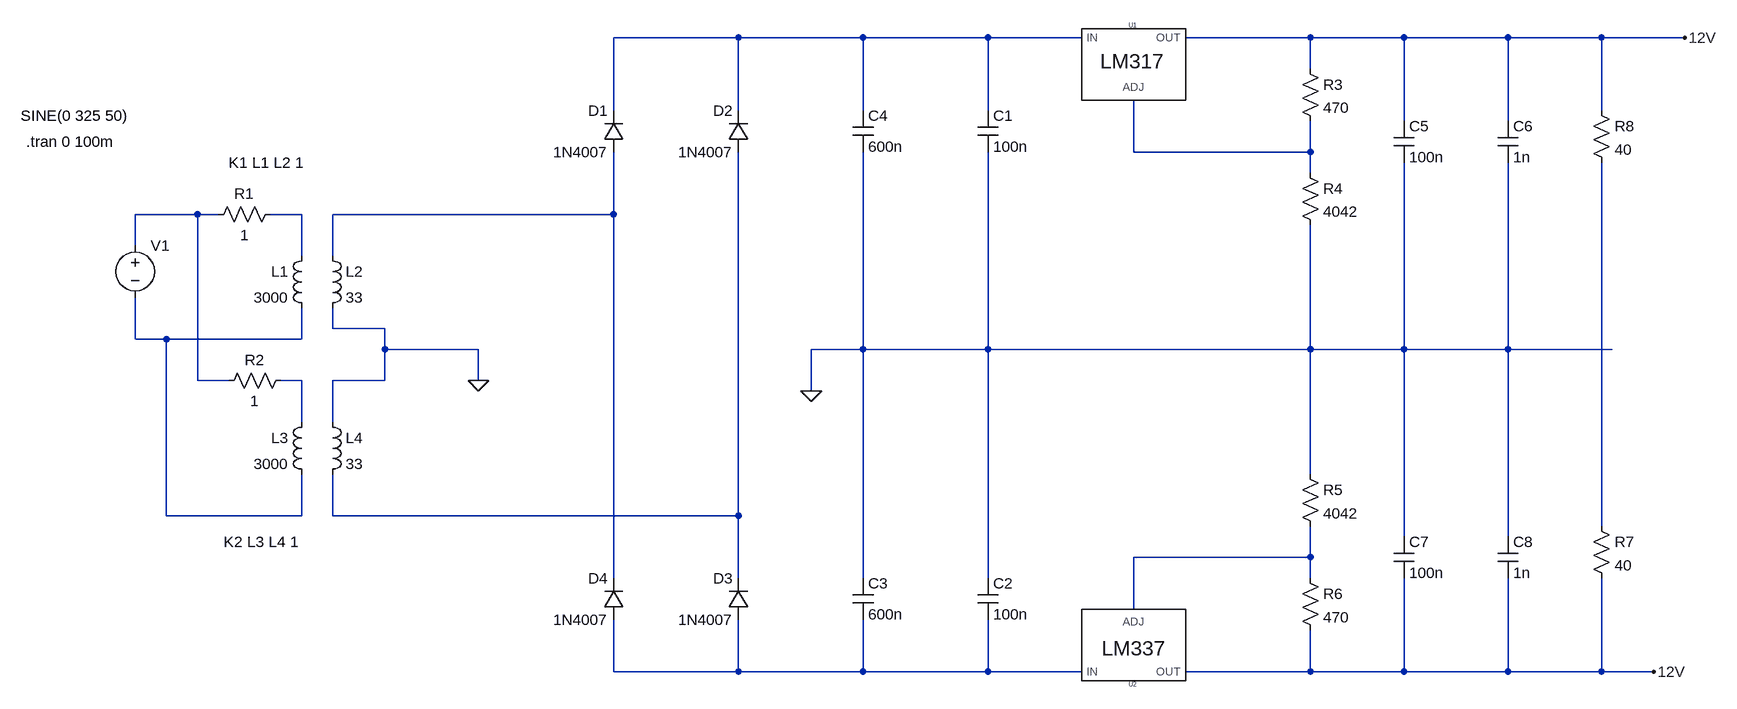
[diagram p0: schematic 3Teholähde.asc]
3Teholähde.asc, the LTspice schematic file:
Version 4.1
SHEET 1 2448 856
WIRE 928 -224 736 -224
WIRE 1120 -224 928 -224
WIRE 1312 -224 1120 -224
WIRE 1456 -224 1312 -224
WIRE 1808 -224 1616 -224
WIRE 1952 -224 1808 -224
WIRE 2112 -224 1952 -224
WIRE 2256 -224 2112 -224
WIRE 2384 -224 2256 -224
WIRE 1808 -176 1808 -224
WIRE 736 -112 736 -224
WIRE 928 -112 928 -224
WIRE 1120 -112 1120 -224
WIRE 1312 -112 1312 -224
WIRE 2256 -112 2256 -224
WIRE 1952 -96 1952 -224
WIRE 2112 -96 2112 -224
WIRE 1536 -48 1536 -128
WIRE 1808 -48 1808 -96
WIRE 1808 -48 1536 -48
WIRE 1808 -16 1808 -48
WIRE 96 48 0 48
WIRE 128 48 96 48
WIRE 256 48 208 48
WIRE 736 48 736 -48
WIRE 736 48 304 48
WIRE 0 96 0 48
WIRE 256 112 256 48
WIRE 304 112 304 48
WIRE 304 224 304 192
WIRE 384 224 304 224
WIRE 0 240 0 176
WIRE 48 240 0 240
WIRE 256 240 256 192
WIRE 256 240 48 240
WIRE 384 256 384 224
WIRE 528 256 384 256
WIRE 1120 256 1120 -48
WIRE 1120 256 1040 256
WIRE 1312 256 1312 -48
WIRE 1312 256 1120 256
WIRE 1808 256 1808 64
WIRE 1808 256 1312 256
WIRE 1952 256 1952 -32
WIRE 1952 256 1808 256
WIRE 2112 256 2112 -32
WIRE 2112 256 1952 256
WIRE 2272 256 2112 256
WIRE 96 304 96 48
WIRE 144 304 96 304
WIRE 256 304 224 304
WIRE 384 304 384 256
WIRE 384 304 304 304
WIRE 528 304 528 256
WIRE 1040 320 1040 256
WIRE 256 368 256 304
WIRE 304 368 304 304
WIRE 1808 448 1808 256
WIRE 48 512 48 240
WIRE 256 512 256 448
WIRE 256 512 48 512
WIRE 304 512 304 448
WIRE 928 512 928 -48
WIRE 928 512 304 512
WIRE 2256 528 2256 -32
WIRE 1952 544 1952 256
WIRE 2112 544 2112 256
WIRE 1808 576 1808 528
WIRE 1808 576 1536 576
WIRE 736 608 736 48
WIRE 928 608 928 512
WIRE 1120 608 1120 256
WIRE 1312 608 1312 256
WIRE 1808 608 1808 576
WIRE 1536 656 1536 576
WIRE 736 752 736 672
WIRE 928 752 928 672
WIRE 928 752 736 752
WIRE 1120 752 1120 672
WIRE 1120 752 928 752
WIRE 1312 752 1312 672
WIRE 1312 752 1120 752
WIRE 1456 752 1312 752
WIRE 1808 752 1808 688
WIRE 1808 752 1616 752
WIRE 1952 752 1952 608
WIRE 1952 752 1808 752
WIRE 2112 752 2112 608
WIRE 2112 752 1952 752
WIRE 2256 752 2256 608
WIRE 2256 752 2112 752
WIRE 2336 752 2256 752
FLAG 528 304 0
FLAG 1040 320 0
FLAG 2336 752 12V
FLAG 2384 -224 12V
SYMBOL voltage 0 80 R0
SYMATTR InstName V1
SYMATTR Value ""
SYMBOL res 224 32 R90
WINDOW 0 0 56 VBottom 2
WINDOW 3 32 56 VTop 2
SYMATTR InstName R1
SYMATTR Value 1
SYMBOL ind 272 96 M0
SYMATTR InstName L1
SYMATTR Value 3000
SYMATTR Type ind
SYMATTR SpiceLine Rser=1m
SYMBOL ind 288 96 R0
SYMATTR InstName L2
SYMATTR Value 33
SYMATTR Type ind
SYMATTR SpiceLine Rser=1m
SYMBOL ind 272 352 M0
SYMATTR InstName L3
SYMATTR Value 3000
SYMATTR Type ind
SYMATTR SpiceLine Rser=1m
SYMBOL ind 288 352 R0
SYMATTR InstName L4
SYMATTR Value 33
SYMATTR Type ind
SYMATTR SpiceLine Rser=1m
SYMBOL res 240 288 R90
WINDOW 0 0 56 VBottom 2
WINDOW 3 32 56 VTop 2
SYMATTR InstName R2
SYMATTR Value 1
SYMBOL cap 1296 -112 R0
SYMATTR InstName C1
SYMATTR Value 100n
SYMBOL cap 1296 608 R0
SYMATTR InstName C2
SYMATTR Value 100n
SYMBOL cap 1104 608 R0
SYMATTR InstName C3
SYMATTR Value 600n
SYMBOL cap 1104 -112 R0
SYMATTR InstName C4
SYMATTR Value 600n
SYMBOL 3LM317 1536 -192 R0
SYMATTR InstName U1
SYMBOL 3LM337 1536 720 M180
SYMATTR InstName U2
SYMBOL res 1792 -192 R0
SYMATTR InstName R3
SYMATTR Value 470
SYMBOL res 1792 -32 R0
SYMATTR InstName R4
SYMATTR Value 4042
SYMBOL res 1792 432 R0
SYMATTR InstName R5
SYMATTR Value 4042
SYMBOL res 1792 592 R0
SYMATTR InstName R6
SYMATTR Value 470
SYMBOL cap 1936 -96 R0
SYMATTR InstName C5
SYMATTR Value 100n
SYMBOL cap 2096 -96 R0
SYMATTR InstName C6
SYMATTR Value 1n
SYMBOL cap 1936 544 R0
SYMATTR InstName C7
SYMATTR Value 100n
SYMBOL cap 2096 544 R0
SYMATTR InstName C8
SYMATTR Value 1n
SYMBOL res 2240 512 R0
SYMATTR InstName R7
SYMATTR Value 40
SYMBOL res 2240 -128 R0
SYMATTR InstName R8
SYMATTR Value 40
SYMBOL diode 752 -48 R180
WINDOW 0 24 64 Left 2
WINDOW 3 24 0 Left 2
SYMATTR InstName D1
SYMATTR Value 1N4007
SYMBOL diode 944 -48 R180
WINDOW 0 24 64 Left 2
WINDOW 3 24 0 Left 2
SYMATTR InstName D2
SYMATTR Value 1N4007
SYMBOL diode 944 672 R180
WINDOW 0 24 64 Left 2
WINDOW 3 24 0 Left 2
SYMATTR InstName D3
SYMATTR Value 1N4007
SYMBOL diode 752 672 R180
WINDOW 0 24 64 Left 2
WINDOW 3 24 0 Left 2
SYMATTR InstName D4
SYMATTR Value 1N4007
TEXT 144 -32 Left 2 !K1 L1 L2 1
TEXT 136 552 Left 2 !K2 L3 L4 1
TEXT -176 -104 Left 2 !SINE(0 325 50)
TEXT -168 -64 Left 2 !.tran 0 100m

The netlist it stands for:
* 3Teholähde.asc
V1 N003 N006
R1 N004 N003 1
L1 N004 N006 3000 Rser=1m
L2 N005 0 33 Rser=1m
L3 N007 N006 3000 Rser=1m
L4 0 N008 33 Rser=1m
R2 N007 N003 1
C1 N001 0 100n
C2 0 N011 100n
C3 0 N011 600n
C4 N001 0 600n
X§U1 N001 N002 12V LM317  ; pins IN ADJ OUT
X§U2 N011 N010 12V LM337  ; pins IN ADJ OUT
R3 12V N002 470
R4 N002 0 4042
R5 0 N010 4042
R6 N010 12V 470
C5 12V 0 100n
C6 12V 0 1n
C7 0 12V 100n
C8 0 12V 1n
R7 N009 12V 40
R8 12V N009 40
D1 N005 N001 1N4007
D2 N008 N001 1N4007
D3 N011 N008 1N4007
D4 N011 N005 1N4007
.model D D
.lib standard.dio
K1 L1 L2 1
K2 L3 L4 1
SINE(0 325 50)
.tran 0 100m
.lib LM317.sub
.lib LM337.sub
.backanno
.end